# EAGLE schematic LED_driver (EAGLE 9.1.3)
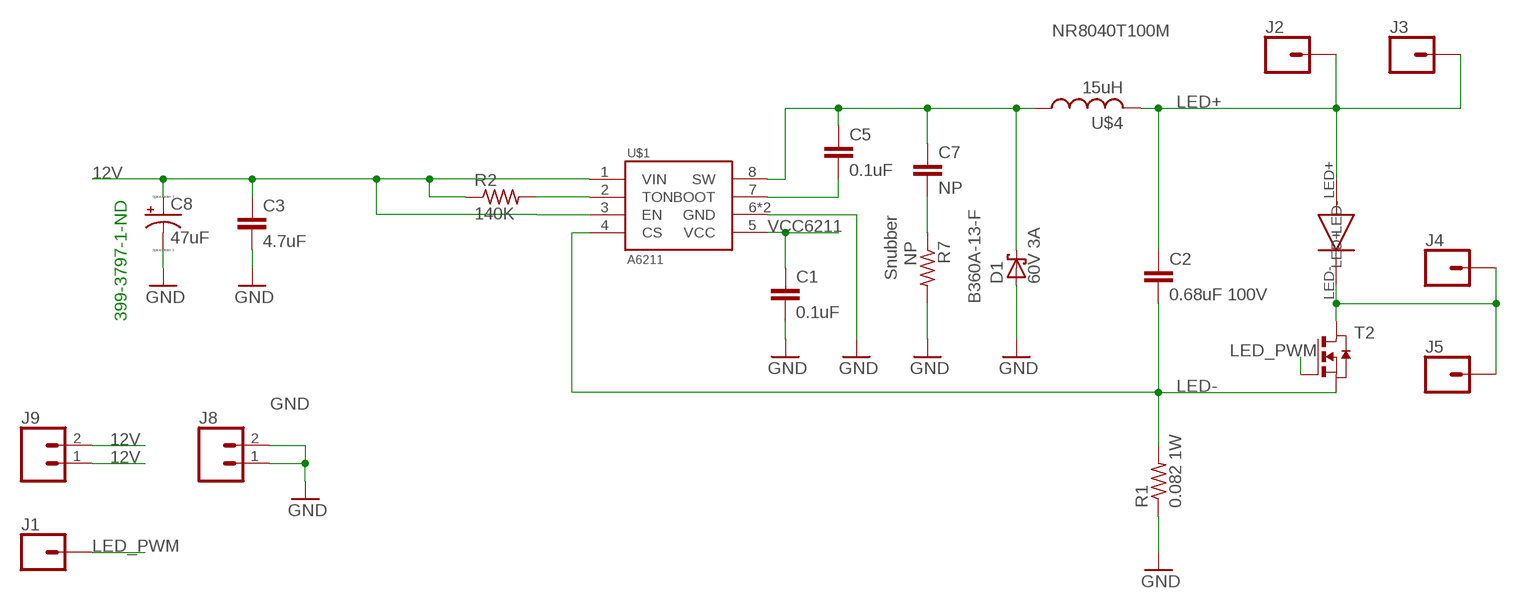
[diagram p0: schematic, sheet 1]

## Parts
C1  0.1uF  C-EUC0603  [C0603]
C2  0.68uF 100V  C-EUC0805  [C0805]
C3  4.7uF  C-EUC0603  [C0603]
C5  0.1uF  C-EUC0603  [C0603]
C7  NP  C-EUC0603  [C0603]
C8  47uF  C-TANTALUM(10UF_150UF)  [CTAN(7.30_4.30MM)]
D1  60V 3A  DIODE-SCHOTTKYSMA  [SMA]
J1  CONN_01  [1X01]
J2  CONN_01  [1X01]
J3  CONN_01  [1X01]
J4  CONN_01  [1X01]
J5  CONN_01  [1X01]
J8  CONN_021X02_NO_SILK  [1X02_NO_SILK]
J9  CONN_021X02_NO_SILK  [1X02_NO_SILK]
R1  0.082 1W  R-US_R2512  [R2512]
R2  140K  R-US_R0603  [R0603]
R7  NP  R-US_R1206  [R1206]
T2  NMOSSOT23  [SOT-23]
U$1  A6211  [SOIC8N-LJ]
U$3  LED_00H53  [LED_00H53]
U$4  15uH  HCMA1305  [HCMA1305]

## Nets
12V: C3.1 C8.+ J9.1 J9.2 R2.1 U$1.1(VIN) U$1.3(EN)
GND: C1.2 C3.2 C8.- D1.A J8.1 J8.2 R1.1 R7.2 U$1.6(GND) U$1.PAD(GND)
LED+: C2.1 J2.1 J3.1 U$3.LED+ U$4.P$2
LED-: C2.2 R1.2 T2.2(S) U$1.4(CS)
LED_PWM: J1.1 T2.3(G)
N$1: R2.2 U$1.2(TON)
N$2: C7.2 R7.1
N$3: J4.1 J5.1 T2.1(D) U$3.LED-
N$4: C5.2 U$1.7(BOOT)
N$5: C5.1 C7.1 D1.C U$1.8(SW) U$4.P$1
VCC6211: C1.1 U$1.5(VCC)

## Notes on the sheet
- NR8040T100M
- Snubber
- B360A-13-F
- 399-3797-1-ND

## Library data of the parts
C1 C2 C5 C7 = resistor:C-EU: CAPACITOR, European symbol
C3 = rcl:C-EU: CAPACITOR, European symbol
C8 = PowerComponents:C-TANTALUM(10UF_150UF)
D1 = BlueRobotics-Main:DIODE-SCHOTTKY
J1-J5 = SparkFun-Connectors:CONN_01: Single connection point. Often used as Generic Header-pin footprint for 0.1 inch spaced/style header connections On any of the 0.1 inch spaced packages, you can populate with these: Break Away Headers - Straight <https://www.sparkfun.com/products/116> (PRT-00116) Break Away Male Headers - Right Angle <https://www.sparkfun.com/products/553> (PRT-00553) Female Headers <https://www.sparkfun.com/products/115> (PRT-00115) Break Away Headers - Machine Pin <https://www.sparkfun.com/products/117> (PRT-00117) Break Away Female Headers - Swiss Machine Pin <https://www.sparkfun.com/products/743> (PRT-00743) This device is also useful as a general connection point to wire up your design to another part of your project. Our various solder wires solder well into these plated through hole pads. Hook-Up Wire - Assortment (Stranded, 22 AWG) <https://www.sparkfun.com/products/11375> (PRT-11375) Hook-Up Wire - Assortment (Solid Core, 22 AWG) <https://www.sparkfun.com/products/11367> (PRT-11367) View the entire wire category on our website here <https://www.sparkfun.com/categories/141> Special notes: SMTSO-256-ET is a "flush mount" nut for a 4-40 screw. We mostly use this on specialty testbeds; it is a nice way to connect hardware to your PCB at an adjustable hieght. Also note, the SNAP packages are for using a snappable style connector. We sell a baggie of snaps and they are also used on two LilyPad designs: Snap Assortment - 30 pack (male and female) <https://www.sparkfun.com/products/11347> (DEV-11347) LilyPad Arduino SimpleSnap <https://www.sparkfun.com/products/10941> (DEV-10941) LilyPad SimpleSnap Protoboard <https://www.sparkfun.com/products/10940> (DEV-10940)
J8 J9 = SparkFun-Connectors:CONN_02: Multi connection point. Often used as Generic Header-pin footprint for 0.1 inch spaced/style header connections On any of the 0.1 inch spaced packages, you can populate with these: Break Away Headers - Straight <https://www.sparkfun.com/products/116> (PRT-00116) Break Away Male Headers - Right Angle <https://www.sparkfun.com/products/553> (PRT-00553) Female Headers <https://www.sparkfun.com/products/115> (PRT-00115) Break Away Headers - Machine Pin <https://www.sparkfun.com/products/117> (PRT-00117) Break Away Female Headers - Swiss Machine Pin <https://www.sparkfun.com/products/743> (PRT-00743) For SCREWTERMINALS and SPRING TERMINALS visit here: Screw Terimnals on SparkFun.com <https://www.sparkfun.com/search/results?term=Screw+Terminals> (5mm/3.5mm/2.54mm spacing) This device is also useful as a general connection point to wire up your design to another part of your project. Our various solder wires solder well into these plated through hole pads. Hook-Up Wire - Assortment (Stranded, 22 AWG) <https://www.sparkfun.com/products/11375> (PRT-11375) Hook-Up Wire - Assortment (Solid Core, 22 AWG) <https://www.sparkfun.com/products/11367> (PRT-11367) View the entire wire category on our website here <https://www.sparkfun.com/categories/141> Special notes: Molex polarized connector foot print use with: PRT-08233 with associated crimp pins and housings. 2.54_SCREWTERM for use with PRT-10571. 3.5mm Screw Terminal footprints for PRT-08084 5mm Screw Terminal footprints for use with PRT-08432
R1 R2 R7 = resistor:R-US_: RESISTOR, American symbol
T2 = zetex:NMOSSOT23: MOS FET; OC_FARNELL: unknown; OC_NEWARK: unknown
U$1 = BlueRobotics-Main:A6211
U$3 = LED_00H53:LED_00H53
U$4 = DiscreteComponents:HCMA1305